# Altium schematic sheet TIVA_2.SchDoc
size A4
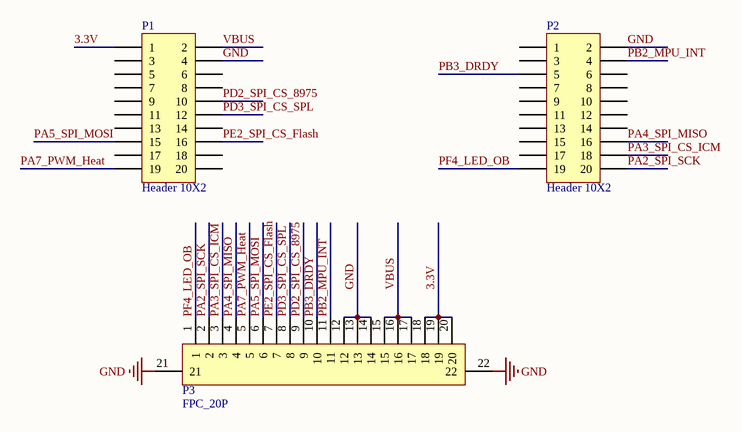
[diagram p0: TIVA_2.SchDoc]

## Parts
P1  Header 10X2  [HDR2X10]
P2  Header 10X2  [HDR2X10]
P3  FPC_20P  [FPC1.0_20P]

## Nets
GND: P1.4 P2.2 P3.12 P3.13 P3.14 P3.21 P3.22
3.3V: P1.1 P3.18 P3.19 P3.20
PA2_SPI_SCK: P2.20 P3.2
PA3_SPI_CS_ICM: P2.18 P3.3
PA4_SPI_MISO: P2.16 P3.4
PA5_SPI_MOSI: P1.15 P3.6
PA7_PWM_Heat: P1.19 P3.5
PB2_MPU_INT: P2.4 P3.11
PB3_DRDY: P2.5 P3.10
PD2_SPI_CS_8975: P1.10 P3.9
PD3_SPI_CS_SPL: P1.12 P3.8
PE2_SPI_CS_Flash: P1.16 P3.7
PF4_LED_OB: P2.19 P3.1
VBUS: P1.2 P3.15 P3.16 P3.17

Not connected (* = marked no-connect by the designer): P1 3 5 6 7 8 9 11 13 14 17 18 20; P2 1 3 6 7 8 9 10 11 12 13 14 15 17

## Library data of the parts
P1 P2 = Header 10X2: Header, 10-Pin, Dual row; LatestRevisionDate: 17-Jul-2002; LatestRevisionNote: Re-released for DXP Platform.; Publisher: Altium Limited